# Altium schematic sheet Blink_Blink_Beep_Boop.SchDoc: External Indicators
size A4; SheetNumber: 5; SheetTotal: 6
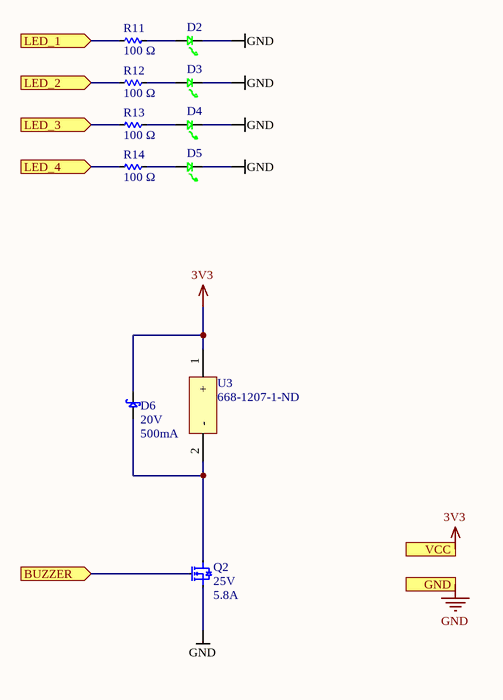
[diagram p0: Blink_Blink_Beep_Boop.SchDoc]

## Parts
D2  LED_LY971  [0805_Diode]  (value not drawn)
D3  LED_LY971  [0805_Diode]  (value not drawn)
D4  LED_LY971  [0805_Diode]  (value not drawn)
D5  LED_LY971  [0805_Diode]  (value not drawn)
D6  Voltage - DC Reverse (Vr) (Max): 20V  Current - Average Rectified (Io): 500mA  [SOD123]  (hidden comment: SCHOTTKY_MBR0520L)
Q2  Drain to Source Voltage (Vdss): 25V  Current - Continuous Drain (Id) @ 25° C: 5.8A  [3SOT23]  (hidden comment: NFET_IRFML8244TRPBF)
R11  Resistance: 100 Ω  [R0603]  (hidden comment: __template_resistor)
R12  Resistance: 100 Ω  [R0603]  (hidden comment: __template_resistor)
R13  Resistance: 100 Ω  [R0603]  (hidden comment: __template_resistor)
R14  Resistance: 100 Ω  [R0603]  (hidden comment: __template_resistor)
U3  Supplier Part Number 1: 668-1207-1-ND  [BUZ_SMT-0540-T-7-R]  (hidden comment: BUZ_SMT-0540-T-7-R)

## Ports
BUZZER (in), GND (in), LED_1 (in), LED_2 (in), LED_3 (in), LED_4 (in), VCC (in)

## Nets
3V3: D6.2 U3.1(+) ; port VCC
GND: D2.1 D3.1 D4.1 D5.1 Q2.2 ; port GND
BUZZER: Q2.1 ; port BUZZER
LED_1: R11.1 ; port LED_1
LED_2: R12.1 ; port LED_2
LED_3: R13.1 ; port LED_3
LED_4: R14.1 ; port LED_4
NetD2_2: D2.2 R11.2
NetD3_2: D3.2 R12.2
NetD4_2: D4.2 R13.2
NetD5_2: D5.2 R14.2
NetD6_1: D6.1 Q2.3 U3.2(-)

## Notes on the sheet
- Title
- Size:
- Date:
- A4
- Number:
- Time:
- Revision:
- Sheet
- of
- File:

## Library data of the parts
D2-D5 = LED_LY971: LED 0805 GREEN 20MA; Manufacturer: OSRAM Opto Semiconductors Inc; Manufacturer Part Number: LG R971-KN-1; Wavelength - Dominant: 570nm; Wavelength - Peak: 572nm; Millicandela Rating: 26.05mcd; Voltage - Forward (Vf) (Typ): 2.2V; Viewing Angle: 160°; Lens Transparency: Diffused; Lens Color: White; Lens Style/Size: Rectangle with Flat Top, 1.30mm x 1.25mm; Supplier 1: Digi-Key; RoHS: RoHS Compliant; Category: Optoelectronics; Stock 1: 89733; Pricing 1: 1=0.08, 10=0.069, 100=0.0548, 250=0.04796, 500=0.04384 (USD); Packaging: Cut Tape (CT); Color: Green; Package / Case: 0805 (2012 Metric); Supplier Device Package: *; Size / Dimension: 2.00mm L x 1.25mm W; Height (Max): 0.80mm; Mounting Type: Surface Mount; ComponentLink1URL: http://www.osram-os.com/Graphics/XPic9/00078860_0.pdf; ComponentLink1Description: http://www.osram-os.com/Graphics/XPic9/00078860_0.pdf; Supplier Part Number 1: 475-1410-1-ND; Current - Test: 20mA
D6 = SCHOTTKY_MBR0520L: DIODE SCHOTTKY 0.5A 20V SOD-123; Manufacturer: Fairchild Semiconductor; Voltage - Forward (Vf) (Max) @ If: 385mV @ 500mA; Speed: Fast Recovery =< 500ns, > 200mA (Io); Current - Reverse Leakage @ Vr: 250µA @ 20V; Supplier 1: Digi-Key; Manufacturer Part Number: MBR0520L; RoHS: RoHS Compliant; Category: Discrete Semiconductor Products; Stock 1: 217232; Pricing 1: 1=0.63, 10=0.43, 100=0.2024, 250=0.1442, 500=0.11006, 750=0.08603, 1000=0.0759 (USD); Diode Type: Schottky; Reverse Recovery Time (trr): -; Capacitance @ Vr, F: -; Mounting Type: Surface Mount; Package / Case: SOD-123; Supplier Device Package: SOD-123; Packaging: Cut Tape (CT); ComponentLink1URL: http://www.fairchildsemi.com/ds/MB/MBR0520L.pdf; ComponentLink1Description: Datasheet; Supplier Part Number 1: MBR0520LCT-ND
Q2 = NFET_IRFML8244TRPBF: MOSFET N-CH 25V 5.8A SOT23; Manufacturer: International Rectifier; FET Type: MOSFET N-Channel, Metal Oxide; FET Feature: Logic Level Gate; Rds On (Max) @ Id, Vgs: 24 mOhm @ 5.8A, 10V; Vgs(th) (Max) @ Id: 2.35V @ 10µA; Gate Charge (Qg) @ Vgs: 5.4nC @ 10V; Input Capacitance (Ciss) @ Vds: 430pF @ 10V; Power - Max: 1.25W; Supplier 1: Digi-Key; Manufacturer Part Number: IRFML8244TRPBF; RoHS: RoHS Compliant; Category: Discrete Semiconductor Products; Stock 1: 13542; Pricing 1: 1=0.41, 10=0.23, 100=0.1491, 250=0.13548, 500=0.1219, 1000=0.11411 (USD); Mounting Type: Surface Mount; Package / Case: TO-236-3, SC-59, SOT-23-3; Supplier Device Package: SOT-23; Packaging: Cut Tape (CT); ComponentLink1URL: http://www.irf.com/product-info/datasheets/data/irfml8244pbf.pdf; ComponentLink1Description: Datasheet; Supplier Part Number 1: IRFML8244TRPBFCT-ND
R11-R14 = 311-100HRCT-ND: RES SMD 100 OHM 1% 1/10W 0603; Manufacturer Part Number: RC0603FR-07100RL; Manufacturer: Yageo; Power (Watts): 0.1W, 1/10W; Resistance (Sortable): 100; Temperature Coefficient: ±100ppm/°C; Tolerance: ±1%; Supplier 1: Digikey; Datasheets: http://www.yageo.com/documents/recent/PYu-RC_Group_51_RoHS_L_9.pdf; Image: //media.digikey.com/Renders/Yageo%20Renders/0603-(1608-Metric).jpg; Supplier Part Number 1: 311-100HRCT-ND; Operating Temperature: -55°C ~ 155°C
U3 = BUZ_SMT-0540-T-7-R: Peak-Peak Signal Buzzer Single Tone 4kHz Magnetic 2 ~ 4V 78dB @ 3V, 10cm; Manufacturer: PUI Audio, Inc.; Driver Circuitry: Transducer, Externally Driven; Voltage Range: 2 ~ 4V; Current - Supply: 100mA; Port Location: Top; Supplier 1: Digi-Key; Manufacturer Part Number: SMT-0540-T-7-R; RoHS: RoHS Compliant; Category: Audio Products; Stock 1: 12397; Pricing 1: 1=3.99, 10=3.325, 100=2.66, 500=2.3275 (USD); Packaging: Cut Tape (CT); Part Status: Active; Input Type: Peak-Peak Signal; Voltage - Rated: 3V; Frequency: 4kHz; Technology: Magnetic; Operating Mode: Single Tone; Duration: -; Sound Pressure Level: 78dB @ 3V, 10cm; Operating Temperature: -30°C ~ 70°C; Approvals: -; Ratings: -; Mounting Type: Surface Mount; Termination: Solder Pads; Size / Dimension: 5.0mm L x 5.0mm W x 2.1mm H; Height - Seated (Max): *; ComponentLink1URL: http://www.puiaudio.com/pdf/SMT-0540-T-7-R.pdf; ComponentLink1Description: http://www.puiaudio.com/pdf/SMT-0540-T-7-R.pdf